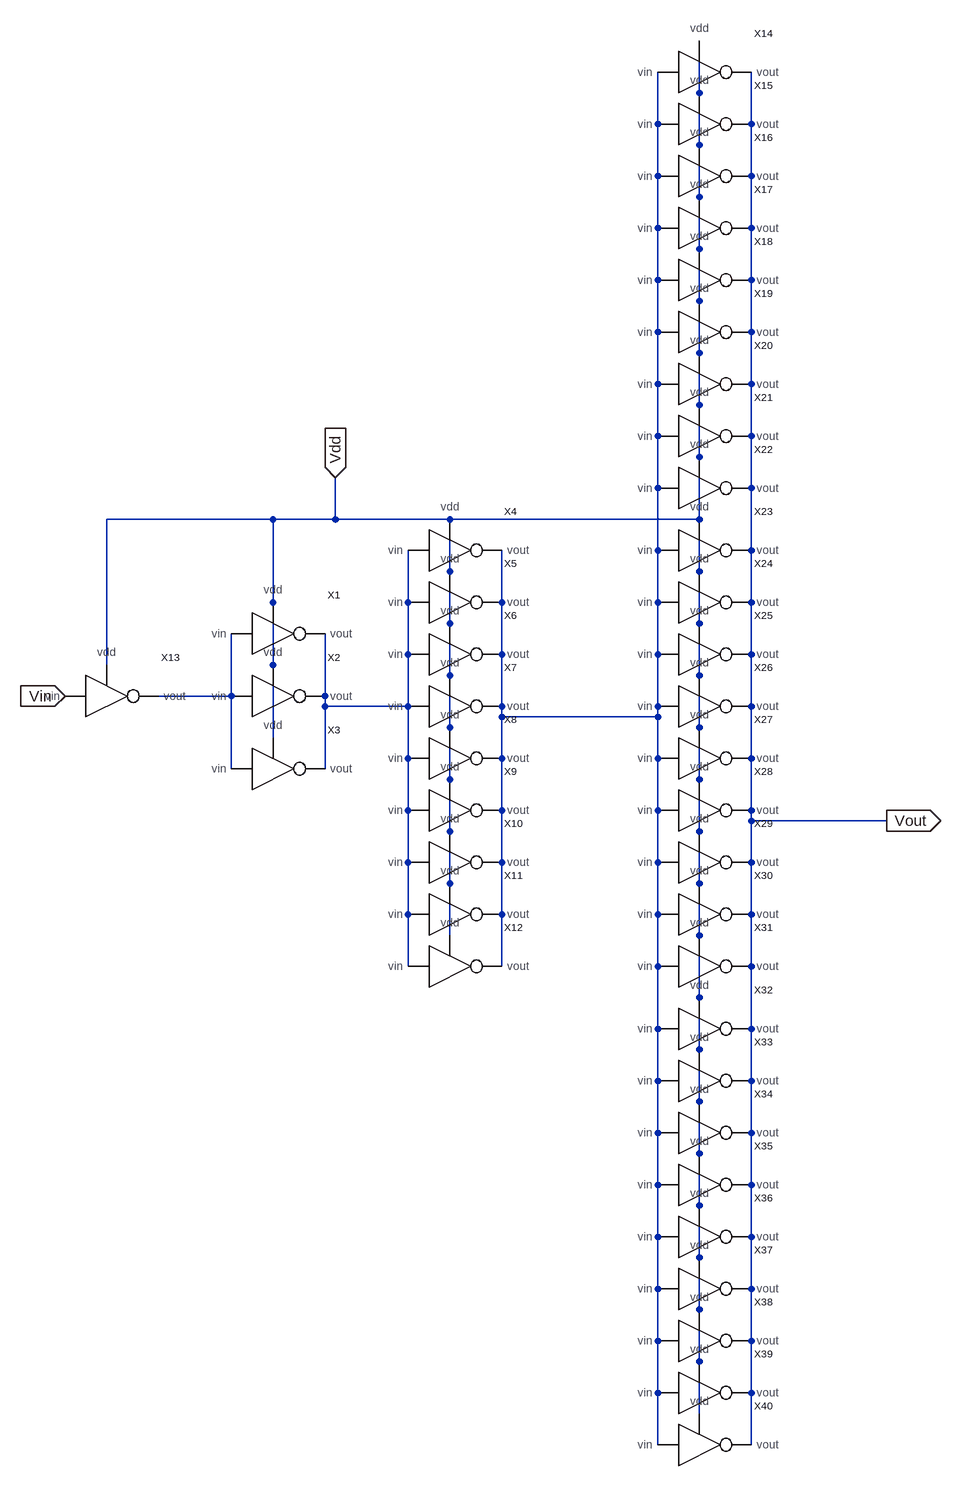
[diagram p0: schematic s_current_boost.asc]
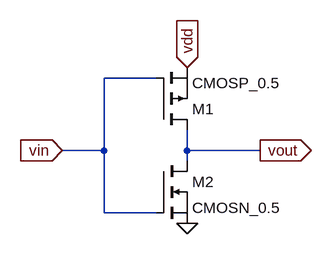
[diagram p1: sub-circuit s_inv.asc]
s_current_boost.asc, the LTspice schematic file:
Version 4
SHEET 1 1556 1460
WIRE 768 -704 768 -784
WIRE 704 -656 704 -736
WIRE 848 -656 848 -736
WIRE 768 -624 768 -704
WIRE 704 -576 704 -656
WIRE 848 -576 848 -656
WIRE 768 -544 768 -624
WIRE 704 -496 704 -576
WIRE 848 -496 848 -576
WIRE 768 -464 768 -544
WIRE 704 -416 704 -496
WIRE 848 -416 848 -496
WIRE 768 -384 768 -464
WIRE 704 -336 704 -416
WIRE 848 -336 848 -416
WIRE 768 -304 768 -384
WIRE 704 -256 704 -336
WIRE 848 -256 848 -336
WIRE 768 -224 768 -304
WIRE 704 -176 704 -256
WIRE 848 -176 848 -256
WIRE 768 -144 768 -224
WIRE 704 -96 704 -176
WIRE 848 -96 848 -176
WIRE 112 -48 -144 -48
WIRE 208 -48 208 -112
WIRE 208 -48 112 -48
WIRE 384 -48 208 -48
WIRE 768 -48 768 -144
WIRE 768 -48 384 -48
WIRE 704 0 704 -96
WIRE 848 0 848 -96
WIRE 384 32 384 -48
WIRE 768 32 768 -48
WIRE 112 80 112 -48
WIRE 320 80 320 0
WIRE 464 80 464 0
WIRE 704 80 704 0
WIRE 848 80 848 0
WIRE 384 112 384 32
WIRE 768 112 768 32
WIRE 320 160 320 80
WIRE 464 160 464 80
WIRE 704 160 704 80
WIRE 848 160 848 80
WIRE -144 176 -144 -48
WIRE 112 176 112 80
WIRE 384 192 384 112
WIRE 768 192 768 112
WIRE 48 224 48 128
WIRE 48 224 -64 224
WIRE 192 224 192 128
WIRE 192 240 192 224
WIRE 320 240 320 160
WIRE 320 240 192 240
WIRE 464 240 464 160
WIRE 704 240 704 160
WIRE 848 240 848 160
WIRE 464 256 464 240
WIRE 704 256 704 240
WIRE 704 256 464 256
WIRE 384 272 384 192
WIRE 768 272 768 192
WIRE 112 288 112 176
WIRE 320 320 320 240
WIRE 464 320 464 256
WIRE 704 320 704 256
WIRE 848 320 848 240
WIRE 48 336 48 224
WIRE 192 336 192 240
WIRE 384 352 384 272
WIRE 768 352 768 272
WIRE 320 400 320 320
WIRE 464 400 464 320
WIRE 704 400 704 320
WIRE 848 400 848 320
WIRE 848 416 848 400
WIRE 1056 416 848 416
WIRE 384 432 384 352
WIRE 768 432 768 352
WIRE 320 480 320 400
WIRE 464 480 464 400
WIRE 704 480 704 400
WIRE 848 480 848 416
WIRE 384 512 384 432
WIRE 768 512 768 432
WIRE 320 560 320 480
WIRE 464 560 464 480
WIRE 704 560 704 480
WIRE 848 560 848 480
WIRE 384 592 384 512
WIRE 768 592 768 512
WIRE 320 640 320 560
WIRE 464 640 464 560
WIRE 704 640 704 560
WIRE 848 640 848 560
WIRE 768 688 768 592
WIRE 704 736 704 640
WIRE 848 736 848 640
WIRE 768 768 768 688
WIRE 704 816 704 736
WIRE 848 816 848 736
WIRE 768 848 768 768
WIRE 704 896 704 816
WIRE 848 896 848 816
WIRE 768 928 768 848
WIRE 704 976 704 896
WIRE 848 976 848 896
WIRE 768 1008 768 928
WIRE 704 1056 704 976
WIRE 848 1056 848 976
WIRE 768 1088 768 1008
WIRE 704 1136 704 1056
WIRE 848 1136 848 1056
WIRE 768 1168 768 1088
WIRE 704 1216 704 1136
WIRE 848 1216 848 1136
WIRE 768 1248 768 1168
WIRE 704 1296 704 1216
WIRE 848 1296 848 1216
WIRE 768 1328 768 1248
WIRE 704 1376 704 1296
WIRE 848 1376 848 1296
FLAG 208 -112 Vdd
IOPIN 208 -112 In
FLAG -208 224 Vin
IOPIN -208 224 In
FLAG 1056 416 Vout
IOPIN 1056 416 Out
SYMBOL s_inv 112 128 R0
SYMATTR InstName X1
SYMBOL s_inv 112 224 R0
SYMATTR InstName X2
SYMBOL s_inv 112 336 R0
SYMATTR InstName X3
SYMBOL s_inv 384 0 R0
SYMATTR InstName X4
SYMBOL s_inv 384 80 R0
SYMATTR InstName X5
SYMBOL s_inv 384 160 R0
SYMATTR InstName X6
SYMBOL s_inv 384 240 R0
SYMATTR InstName X7
SYMBOL s_inv 384 320 R0
SYMATTR InstName X8
SYMBOL s_inv 384 400 R0
SYMATTR InstName X9
SYMBOL s_inv 384 480 R0
SYMATTR InstName X10
SYMBOL s_inv 384 560 R0
SYMATTR InstName X11
SYMBOL s_inv 384 640 R0
SYMATTR InstName X12
SYMBOL s_inv -144 224 R0
SYMATTR InstName X13
SYMBOL s_inv 768 -736 R0
SYMATTR InstName X14
SYMBOL s_inv 768 -656 R0
SYMATTR InstName X15
SYMBOL s_inv 768 -576 R0
SYMATTR InstName X16
SYMBOL s_inv 768 -496 R0
SYMATTR InstName X17
SYMBOL s_inv 768 -416 R0
SYMATTR InstName X18
SYMBOL s_inv 768 -336 R0
SYMATTR InstName X19
SYMBOL s_inv 768 -256 R0
SYMATTR InstName X20
SYMBOL s_inv 768 -176 R0
SYMATTR InstName X21
SYMBOL s_inv 768 -96 R0
SYMATTR InstName X22
SYMBOL s_inv 768 0 R0
SYMATTR InstName X23
SYMBOL s_inv 768 80 R0
SYMATTR InstName X24
SYMBOL s_inv 768 160 R0
SYMATTR InstName X25
SYMBOL s_inv 768 240 R0
SYMATTR InstName X26
SYMBOL s_inv 768 320 R0
SYMATTR InstName X27
SYMBOL s_inv 768 400 R0
SYMATTR InstName X28
SYMBOL s_inv 768 480 R0
SYMATTR InstName X29
SYMBOL s_inv 768 560 R0
SYMATTR InstName X30
SYMBOL s_inv 768 640 R0
SYMATTR InstName X31
SYMBOL s_inv 768 736 R0
SYMATTR InstName X32
SYMBOL s_inv 768 816 R0
SYMATTR InstName X33
SYMBOL s_inv 768 896 R0
SYMATTR InstName X34
SYMBOL s_inv 768 976 R0
SYMATTR InstName X35
SYMBOL s_inv 768 1056 R0
SYMATTR InstName X36
SYMBOL s_inv 768 1136 R0
SYMATTR InstName X37
SYMBOL s_inv 768 1216 R0
SYMATTR InstName X38
SYMBOL s_inv 768 1296 R0
SYMATTR InstName X39
SYMBOL s_inv 768 1376 R0
SYMATTR InstName X40

s_inv.asc, the sub-circuit schematic file:
Version 4
SHEET 1 880 680
WIRE 128 -112 48 -112
WIRE 48 0 48 -112
WIRE 48 0 -16 0
WIRE 176 0 176 -32
WIRE 288 0 176 0
WIRE 176 16 176 0
WIRE 48 96 48 0
WIRE 128 96 48 96
FLAG 288 0 vout
IOPIN 288 0 Out
FLAG -16 0 vin
IOPIN -16 0 In
FLAG 176 -128 vdd
IOPIN 176 -128 In
FLAG 176 112 0
SYMBOL pmos 128 -32 M180
SYMATTR InstName M1
SYMATTR Value CMOSP_0.5
SYMBOL nmos 128 16 R0
SYMATTR InstName M2
SYMATTR Value CMOSN_0.5

The netlist it stands for:
* s_current_boost.asc
XX1 N003 N002 Vdd s_inv
XX2 N003 N002 Vdd s_inv
XX3 N003 N002 Vdd s_inv
XX4 N002 N001 Vdd s_inv
XX5 N002 N001 Vdd s_inv
XX6 N002 N001 Vdd s_inv
XX7 N002 N001 Vdd s_inv
XX8 N002 N001 Vdd s_inv
XX9 N002 N001 Vdd s_inv
XX10 N002 N001 Vdd s_inv
XX11 N002 N001 Vdd s_inv
XX12 N002 N001 Vdd s_inv
XX13 Vin N003 Vdd s_inv
XX14 N001 Vout Vdd s_inv
XX15 N001 Vout Vdd s_inv
XX16 N001 Vout Vdd s_inv
XX17 N001 Vout Vdd s_inv
XX18 N001 Vout Vdd s_inv
XX19 N001 Vout Vdd s_inv
XX20 N001 Vout Vdd s_inv
XX21 N001 Vout Vdd s_inv
XX22 N001 Vout Vdd s_inv
XX23 N001 Vout Vdd s_inv
XX24 N001 Vout Vdd s_inv
XX25 N001 Vout Vdd s_inv
XX26 N001 Vout Vdd s_inv
XX27 N001 Vout Vdd s_inv
XX28 N001 Vout Vdd s_inv
XX29 N001 Vout Vdd s_inv
XX30 N001 Vout Vdd s_inv
XX31 N001 Vout Vdd s_inv
XX32 N001 Vout Vdd s_inv
XX33 N001 Vout Vdd s_inv
XX34 N001 Vout Vdd s_inv
XX35 N001 Vout Vdd s_inv
XX36 N001 Vout Vdd s_inv
XX37 N001 Vout Vdd s_inv
XX38 N001 Vout Vdd s_inv
XX39 N001 Vout Vdd s_inv
XX40 N001 Vout Vdd s_inv

* block symbol definitions
.subckt s_inv vin vout vdd
M1 vout vin vdd vdd CMOSP_0.5
M2 vout vin 0 0 CMOSN_0.5
.ends s_inv

.model NMOS NMOS
.model PMOS PMOS
.lib standard.mos
.backanno
.end